# Altium project ArduinoSTM32.PrjPcb
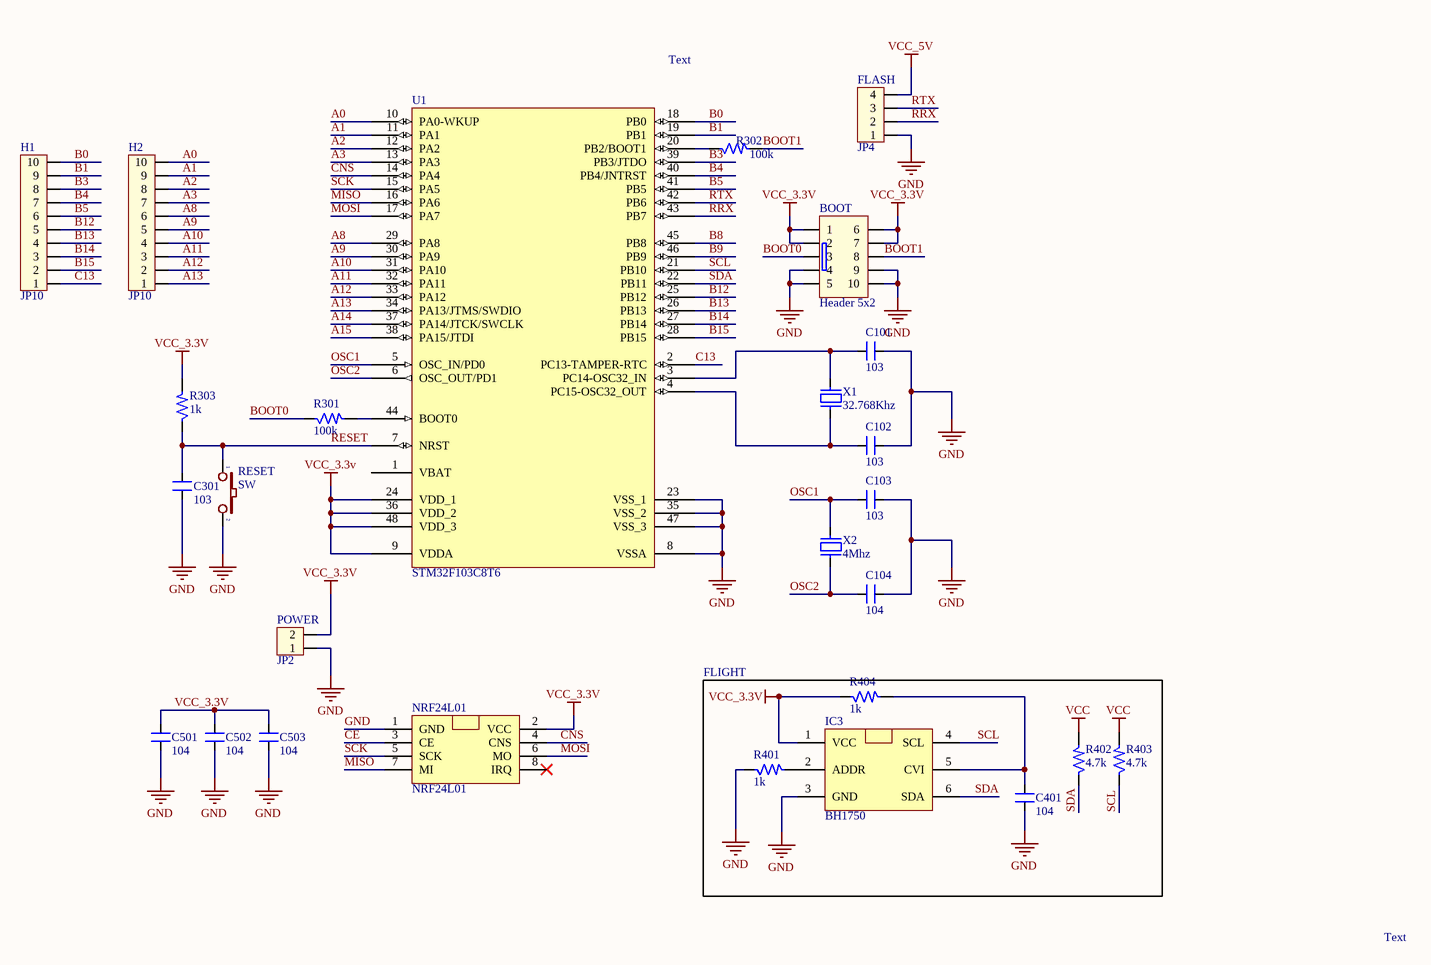
[diagram p0: ArduinoSTM32.SchDoc]
1 sheet, 27 parts. Net scope: global (net labels, ports and power ports of the same name join across sheets).
Board file: ArduinoSTM32.PcbDoc

## Sheet ArduinoSTM32.SchDoc
size B

### Parts
BOOT  Header 5x2  [HED2X5_cen]
C101  103  [SM-0805]
C102  103  [SM-0805]
C103  103  [SM-0805]
C104  104  [SM-0805]
C301  103  [SM-0805]
C401  104  [CN2]
C501  104  [CN2]
C502  104  [CN2]
C503  104  [CN2]
FLASH  JP4  [CON4]
H1  JP10  [CON10]
H2  JP10  [CON10]
IC3  BH1750  [BH1750]
NRF24L01  NRF24L01  [NRF24L01]
POWER  JP2  [CON2]
R301  100k  [SM-1206]
R302  100k  [SM-1206]
R303  1k  [SM-1206]
R401  1k  [SM-0805]
R402  4.7k  [SM-0805]
R403  4.7k  [SM-0805]
R404  1k  [SM-0805]
RESET  SW  [SW2]
U1  STM32F103C8T6  [TQFP48_N]
X1  32.768Khz  [XT32kn]
X2  4Mhz  [XT2]

### Blocks framed on the sheet
FLIGHT: C401 IC3 R401-R404

### Nets
GND: BOOT.4 BOOT.5 BOOT.9 BOOT.10 C101.2 C102.2 C103.2 C104.2 C301.1 C401.1 C501.1 C502.1 C503.1 FLASH.1 IC3.3(GND) NRF24L01.1(GND) POWER.1 R401.1 RESET.2 U1.8(VSSA) U1.23(VSS_1) U1.35(VSS_2) U1.47(VSS_3)
VCC: R402.2 R403.2
VCC_3.3V: BOOT.1 BOOT.2 BOOT.6 BOOT.7 C501.2 C502.2 C503.2 IC3.1(VCC) NRF24L01.2(VCC) POWER.2 R303.2 R404.1 U1.9(VDDA) U1.24(VDD_1) U1.36(VDD_2) U1.48(VDD_3)
VCC_5V: FLASH.4
A0: H2.10 U1.10(PA0-WKUP)
A1: H2.9 U1.11(PA1)
A2: H2.8 U1.12(PA2)
A3: H2.7 U1.13(PA3)
A8: H2.6 U1.29(PA8)
A9: H2.5 U1.30(PA9)
A10: H2.4 U1.31(PA10)
A11: H2.3 U1.32(PA11)
A12: H2.2 U1.33(PA12)
A13: H2.1 U1.34(PA13/JTMS/SWDIO)
A14: U1.37(PA14/JTCK/SWCLK)
A15: U1.38(PA15/JTDI)
B0: H1.10 U1.18(PB0)
B1: H1.9 U1.19(PB1)
B3: H1.8 U1.39(PB3/JTDO)
B4: H1.7 U1.40(PB4/JNTRST)
B5: H1.6 U1.41(PB5)
B8: U1.45(PB8)
B9: U1.46(PB9)
B12: H1.5 U1.25(PB12)
B13: H1.4 U1.26(PB13)
B14: H1.3 U1.27(PB14)
B15: H1.2 U1.28(PB15)
BOOT0: BOOT.3 R301.1
BOOT1: BOOT.8 R302.2
C13: H1.1 U1.2(PC13-TAMPER-RTC)
CE: NRF24L01.3(CE)
CNS: NRF24L01.4(CNS) U1.14(PA4)
MISO: NRF24L01.7(MI) U1.16(PA6)
MOSI: NRF24L01.6(MO) U1.17(PA7)
OSC1: C103.1 U1.5(OSC_IN/PD0) X2.2
OSC2: C104.1 U1.6(OSC_OUT/PD1) X2.1
RESET: C301.2 R303.1 RESET.1 U1.7(NRST)
RRX: FLASH.2 U1.43(PB7)
RTX: FLASH.3 U1.42(PB6)
SCK: NRF24L01.5(SCK) U1.15(PA5)
SCL: IC3.4(SCL) R403.1 U1.21(PB10)
SDA: IC3.6(SDA) R402.1 U1.22(PB11)
NetC101_1: C101.1 U1.3(PC14-OSC32_IN) X1.2
NetC102_1: C102.1 U1.4(PC15-OSC32_OUT) X1.1
NetC401_2: C401.2 IC3.5(CVI) R404.2
NetIC3_2: IC3.2(ADDR) R401.2
NetR301_2: R301.2 U1.44(BOOT0)
NetR302_1: R302.1 U1.20(PB2/BOOT1)

Not connected (* = marked no-connect by the designer): NRF24L01 8(IRQ)*; U1 1(VBAT)

### Notes on the sheet
- Text

### Library data of the parts
BOOT = HED5x2: Value: Header 5x2
C101-C103 C301 = CM: Cap SMD; Value: 103
C104 = CM: Cap SMD; Value: 103
C401 C501-C503 = CN2: Cap np 104 => 105pF; Value: 0.1uF
FLASH = Con4: Connector 4; Value: Connector 4
H1 H2 = Con10: Connector 10; Value: Connector 10
POWER = Con2: Connector 2; Value: Connector 2
R301-R303 R401-R404 = R: Resistor 1/4W; Value: R1/4W - 1K
RESET = SW2: Switch button 2 pin; Value: SW chip 2 pin
U1 = STM32F103C8T6: STM32 ARM-based 32-bit MCU with 64 Kbytes Flash, 48-pin LQFP, Industrial Temperature; Published: 30-May-2008; DatasheetVersion: rev6, Mar-2008; PackageVersion: Mar-2008; PackageReference: LQFP48; Publisher: Altium Limited; PackageDescription: 48-Pin Low-Profile Quad Flat Pack, 7 x 7 mm Body, 0.5 mm Pitch (LQFP48); ComponentLink1Description: Manufacturer Link; ComponentLink1URL: www.st.com/stm32; ComponentLink2Description: Datasheet; ComponentLink2URL: http://www.st.com/stonline/products/literature/ds/13587.pdf
X1 = XT2: Crystal For all Crystal 2pin.; Value: 4Mhz
X2 = XT2: Crystal For all Crystal 2pin.; Value: 4Mhz